# EAGLE design iv_diff (EAGLE 5.06)
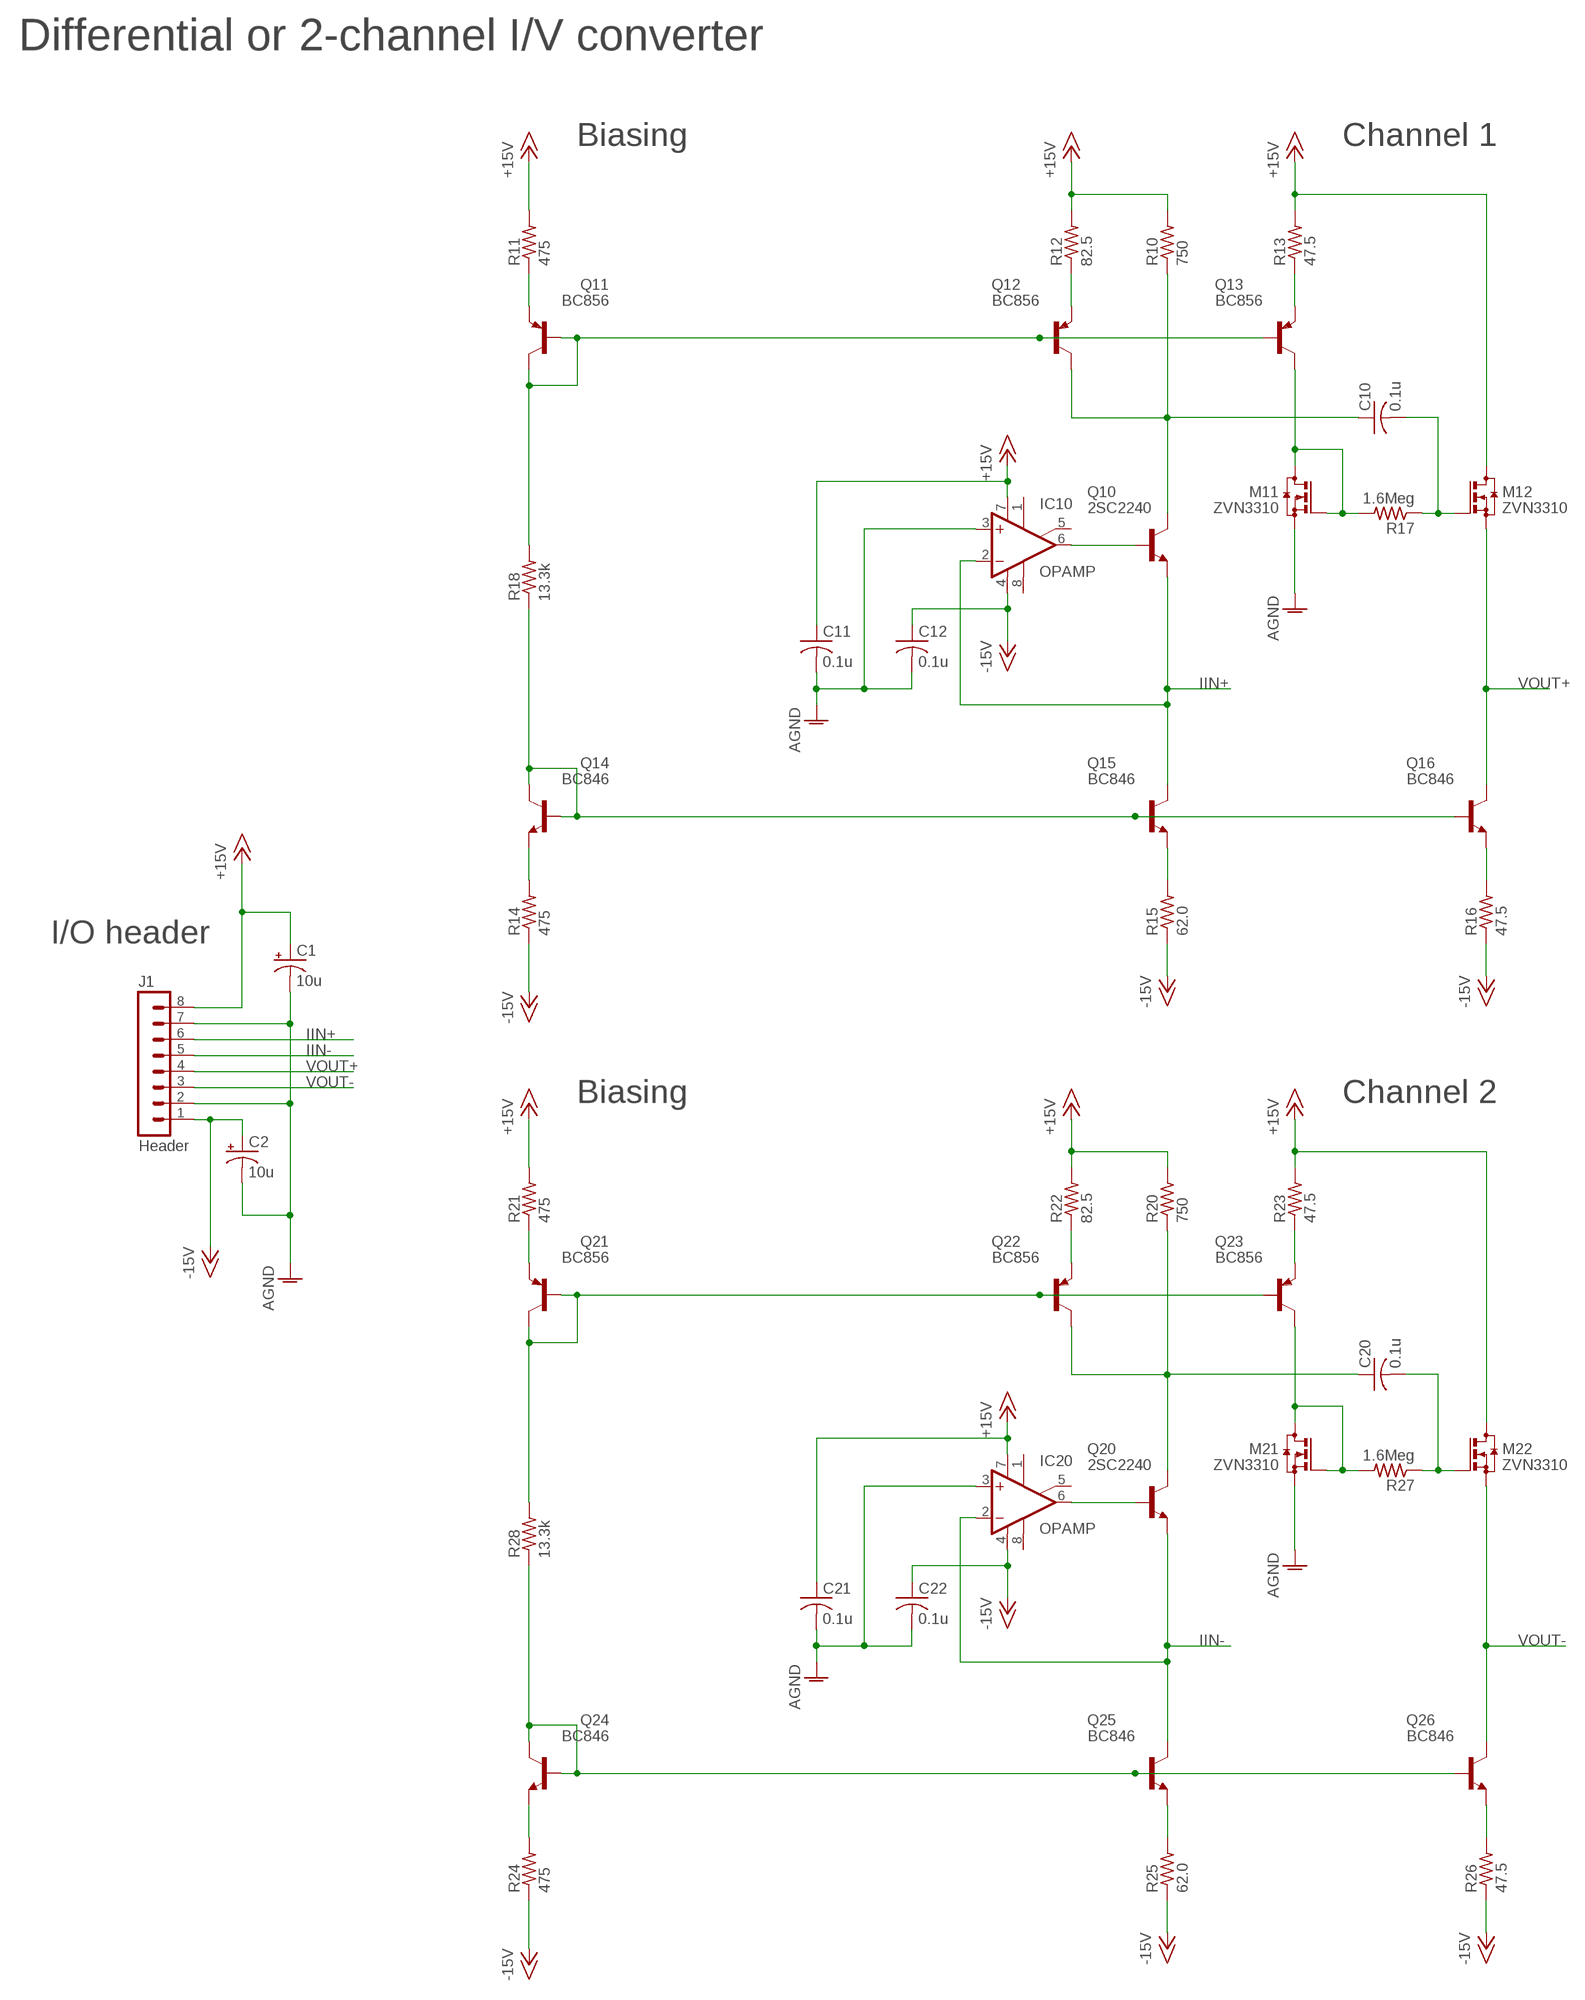
[diagram p0: schematic, sheet 1]

## Parts
C1  10u  CPOL-USC/6032-28R  [C/6032-28R]
C2  10u  CPOL-USC/6032-28R  [C/6032-28R]
C10  0.1u  C-USC1812  [C1812]
C11  0.1u  C-USC1206  [C1206]
C12  0.1u  C-USC1206  [C1206]
C20  0.1u  C-USC1812  [C1812]
C21  0.1u  C-USC1206  [C1206]
C22  0.1u  C-USC1206  [C1206]
IC10  OPAMP  AD797N  [DIL08]
IC20  OPAMP  AD797N  [DIL08]
J1  Header  MA08-1  [MA08-1]
M11  ZVN3310  BSS123  [SOT23]
M12  ZVN3310  BSS123  [SOT23]
M21  ZVN3310  BSS123  [SOT23]
M22  ZVN3310  BSS123  [SOT23]
Q10  2SC2240  [TO92-ECB]
Q11  BC856  BC856BSMD  [SOT23-BEC]
Q12  BC856  BC856BSMD  [SOT23-BEC]
Q13  BC856  BC856BSMD  [SOT23-BEC]
Q14  BC846  [SOT23]
Q15  BC846  [SOT23]
Q16  BC846  [SOT23]
Q20  2SC2240  [TO92-ECB]
Q21  BC856  BC856BSMD  [SOT23-BEC]
Q22  BC856  BC856BSMD  [SOT23-BEC]
Q23  BC856  BC856BSMD  [SOT23-BEC]
Q24  BC846  [SOT23]
Q25  BC846  [SOT23]
Q26  BC846  [SOT23]
R10  750  R-US_R1206  [R1206]
R11  475  R-US_R1206  [R1206]
R12  82.5  R-US_R1206  [R1206]
R13  47.5  R-US_R1206  [R1206]
R14  475  R-US_R1206  [R1206]
R15  62.0  R-US_R1206  [R1206]
R16  47.5  R-US_R1206  [R1206]
R17  1.6Meg  R-US_R1206  [R1206]
R18  13.3k  R-US_R1206  [R1206]
R20  750  R-US_R1206  [R1206]
R21  475  R-US_R1206  [R1206]
R22  82.5  R-US_R1206  [R1206]
R23  47.5  R-US_R1206  [R1206]
R24  475  R-US_R1206  [R1206]
R25  62.0  R-US_R1206  [R1206]
R26  47.5  R-US_R1206  [R1206]
R27  1.6Meg  R-US_R1206  [R1206]
R28  13.3k  R-US_R1206  [R1206]

## Nets
+15V: C1.+ C11.1 C21.1 IC10.7(V+) IC20.7(V+) J1.8 M12.3(D) M22.3(D) R10.2 R11.2 R12.2 R13.2 R20.2 R21.2 R22.2 R23.2
-15V: C2.+ C12.1 C22.1 IC10.4(V-) IC20.4(V-) J1.1 R14.1 R15.1 R16.1 R24.1 R25.1 R26.1
AGND: C1.- C2.- C11.2 C12.2 C21.2 C22.2 IC10.3(+IN) IC20.3(+IN) J1.2 J1.7 M11.2(S) M21.2(S)
IIN+: IC10.2(-IN) J1.6 Q10.E Q15.3(C)
IIN-: IC20.2(-IN) J1.5 Q20.E Q25.3(C)
N$1: Q14.2(E) R14.2
N$2: Q14.1(B) Q14.3(C) Q15.1(B) Q16.1(B) R18.1
N$3: Q24.2(E) R24.2
N$4: Q11.E R11.1
N$5: Q11.B Q11.C Q12.B Q13.B R18.2
N$6: Q12.E R12.1
N$7: C10.1 Q10.C Q12.C R10.1
N$8: Q24.1(B) Q24.3(C) Q25.1(B) Q26.1(B) R28.1
N$9: Q15.2(E) R15.2
N$10: IC10.6(OUT) Q10.B
N$11: Q13.E R13.1
N$12: Q21.E R21.1
N$13: Q16.2(E) R16.2
N$14: M11.1(G) M11.3(D) Q13.C R17.2
N$15: C10.2 M12.1(G) R17.1
N$16: Q21.B Q21.C Q22.B Q23.B R28.2
N$17: Q22.E R22.1
N$18: C20.1 Q20.C Q22.C R20.1
N$19: Q25.2(E) R25.2
N$20: IC20.6(OUT) Q20.B
N$21: Q23.E R23.1
N$22: Q26.2(E) R26.2
N$23: M21.1(G) M21.3(D) Q23.C R27.2
N$24: C20.2 M22.1(G) R27.1
VOUT+: J1.4 M12.2(S) Q16.3(C)
VOUT-: J1.3 M22.2(S) Q26.3(C)
Unconnected: IC10.1(ON1) IC10.5(ON2) IC10.8(OPT) IC20.1(ON1) IC20.5(ON2) IC20.8(OPT)

## Notes on the sheet
- Differential or 2-channel I/V converter
- Biasing | Channel 1
- I/O header
- Biasing | Channel 2

## Library data of the parts
C1 C2 = rcl:CPOL-US: POLARIZED CAPACITOR, American symbol
C10-C12 C20-C22 = rcl:C-US: CAPACITOR, American symbol
IC10 IC20 = linear:AD797: OP AMP
J1 = cdp:MA08-1: PIN HEADER
M11 M12 M21 M22 = transistor-small-signal:BSS123: N-CHANNEL MOS FET
Q10 Q20 = cdp:2SC2240: NPN Silicon Epitaxial Planar Transistor Source: SEMTECH ELECTRONICS LTD. ... 2SC945 2.pdf
Q11-Q13 Q21-Q23 = transistor-pnp:BC856*: PNP Transistror
Q14-Q16 Q24-Q26 = transistor:BC846: NPN TRANSISTOR
R10-R18 R20-R28 = rcl:R-US_: RESISTOR, American symbol

## Board
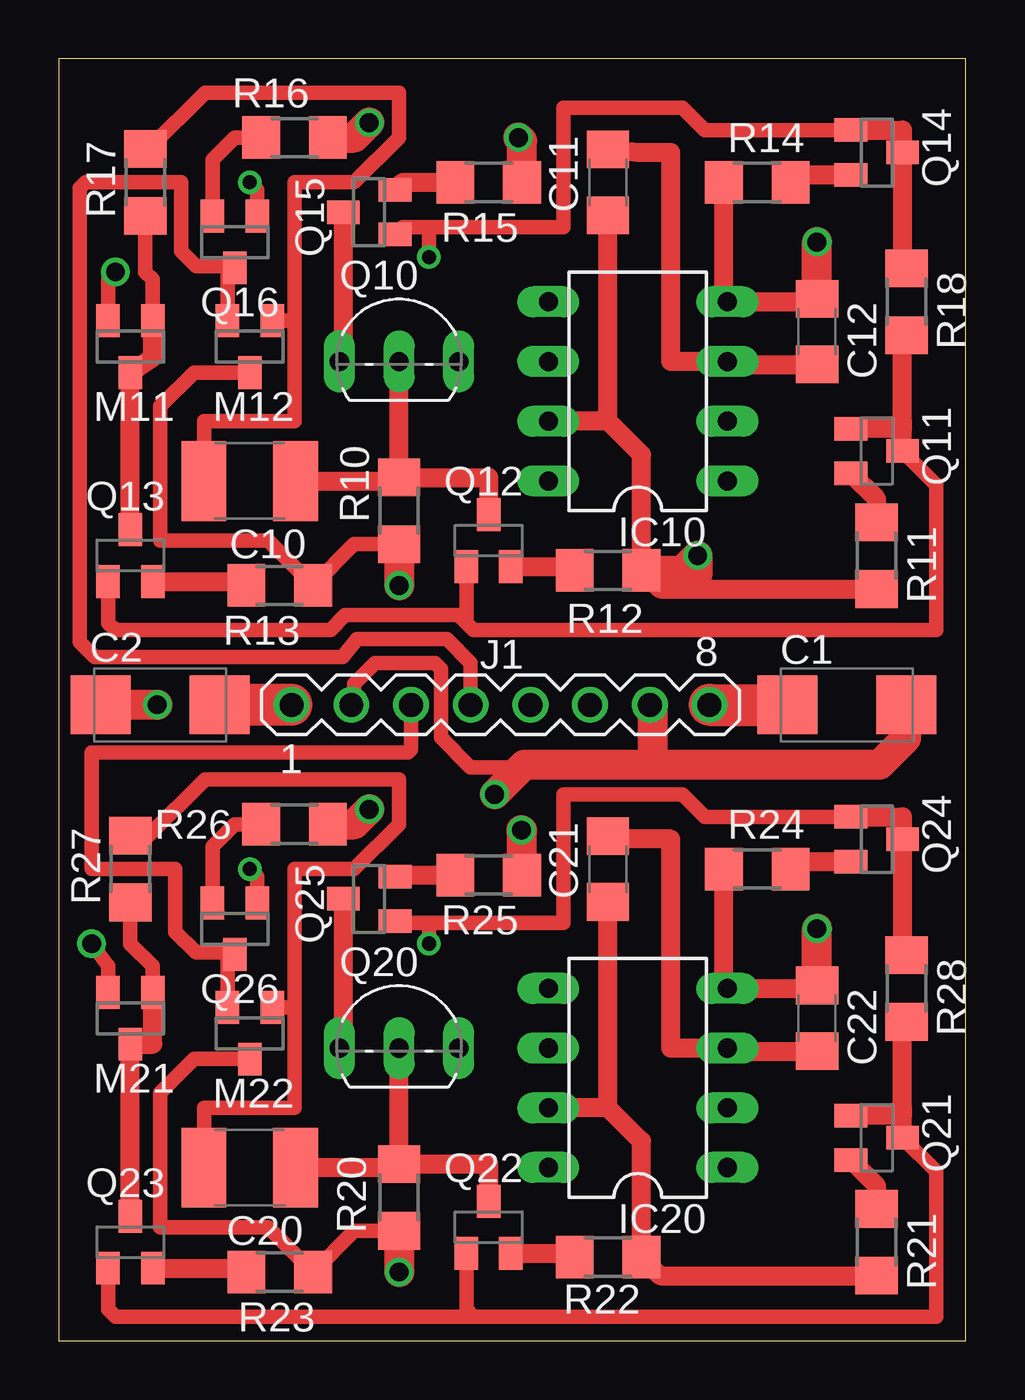
[diagram p1: board, top side]
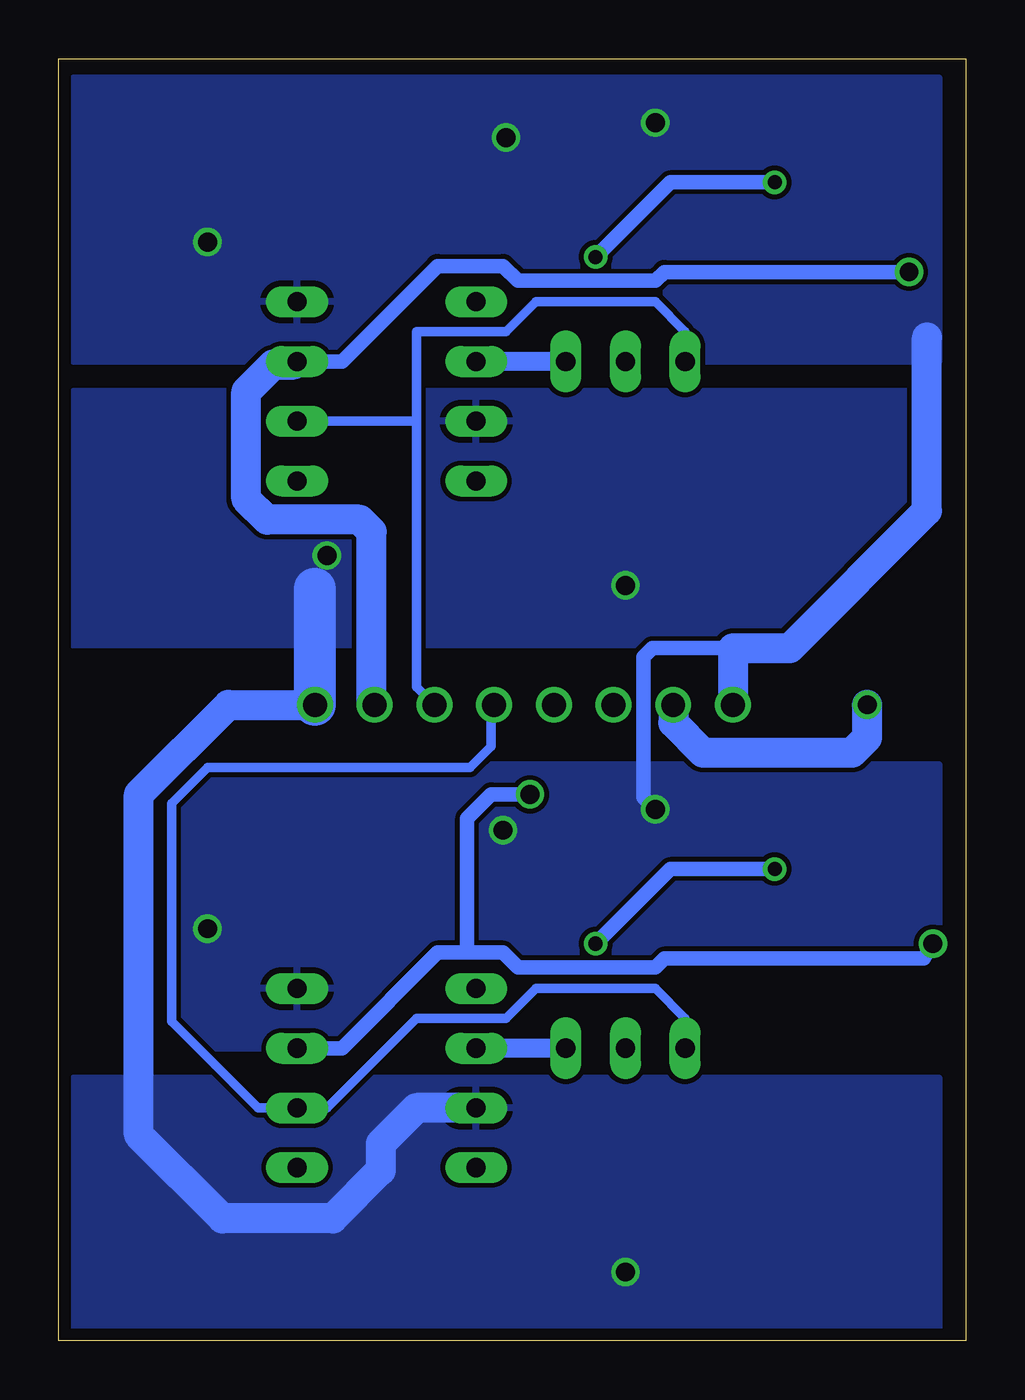
[diagram p2: board, bottom side, seen from below]

Size 38.59 x 54.53 mm. Coordinates in mm from the lower left corner, seen from the top.
Outline: 0,0 38.59,0 38.59,54.53 0,54.53 0,0
Copper layers (1*16): Top 0.035mm / dielectric 1.5mm / Bottom 0.035mm
Design rules "default *": minimum track width 10mil, minimum drill 20mil, track to track 8mil, track to pad 8mil, pad to pad 8mil, via to via 8mil, smd to smd 8mil, copper to edge 20mil, drill to drill 8mil, minimum pad ring 10mil, minimum via ring 8mil, stop-mask expansion 4mil, vias tented up to drill 0mil, thermal gap 10mil

### Footprints (pad centres in the part's own frame; a part is rotated, then mirrored left to right if it is on the bottom)
C/6032-28R = smd 2.55 x 2.5: + 2.525,0; - -2.525,0
C1812 = smd 1.9 x 3.4: 1 -1.95,0; 2 1.95,0
C1206 = smd 1.6 x 1.8: 1 -1.4,0; 2 1.4,0
DIL08 = drill 0.813 long: 1 -3.81,-3.81; 2 -1.27,-3.81; 3 1.27,-3.81; 4 3.81,-3.81; 5 3.81,3.81; 6 1.27,3.81; 7 -1.27,3.81; 8 -3.81,3.81
MA08-1 = drill 1.016 pad 1.422 round: 1 -8.89,0; 2 -6.35,0; 3 -3.81,0; 4 -1.27,0; 5 1.27,0; 6 3.81,0; 7 6.35,0; 8 8.89,0
SOT23 = smd 1 x 1.4: 1 -0.95,-1.1; 2 0.95,-1.1; 3 0,1.1
TO92-ECB = drill 0.813 long: B 2.54,0; C 0,0; E -2.54,0
SOT23-BEC = smd 1 x 1.4: B -0.95,-1.1; C 0,1.1; E 0.95,-1.1
R1206 = smd 1.6 x 1.803: 1 -1.422,0; 2 1.422,0

### Placement (x,y rotation side)
C1  33.53,27.05 180 top
C2  4.32,27.05 0 top
C10  8.13,36.58 180 top
C11  23.37,49.28 90 top
C12  32.26,42.93 270 top
C20  8.13,7.37 180 top
C21  23.37,20.07 90 top
C22  32.26,13.72 270 top
IC10  24.64,40.39 90 top
IC20  24.64,11.18 90 top
J1  18.8,27.05 0 top
M11  3.05,42.29 180 top
M12  8.13,42.29 180 top
M21  3.05,13.72 180 top
M22  8.13,13.08 180 top
Q10  14.48,41.66 0 top
Q11  34.8,37.85 270 top
Q12  18.29,34.04 0 top
Q13  3.05,33.4 0 top
Q14  34.8,50.55 270 top
Q15  13.21,48.01 90 top
Q16  7.49,46.74 180 top
Q20  14.48,12.45 0 top
Q21  34.8,8.64 270 top
Q22  18.29,4.83 0 top
Q23  3.05,4.19 0 top
Q24  34.8,21.34 270 top
Q25  13.21,18.8 90 top
Q26  7.49,17.53 180 top
R10  14.48,35.31 270 top
R11  34.8,33.4 270 top
R12  23.37,32.77 0 top
R13  9.4,32.13 0 top
R14  29.72,49.28 0 top
R15  18.29,49.28 180 top
R16  10.03,51.18 180 top
R17  3.68,49.28 270 top
R18  36.07,44.2 270 top
R20  14.48,6.1 270 top
R21  34.8,4.19 270 top
R22  23.37,3.56 0 top
R23  9.4,2.92 0 top
R24  29.72,20.07 0 top
R25  18.29,19.81 180 top
R26  10.03,21.97 180 top
R27  3.05,20.07 270 top
R28  36.07,14.99 270 top

### Tracks (layer width: path | path; a pad name or v marks a point on that pad's centre or on a via)
+15V  (via drill 0.8)
  Top 0.406: 27.18,32.64 27.18,32.49 27.69,31.98
  Top 0.61: M12.3 5.76,41.19 4.32,39.75 4.32,34.04 8.91,34.04 R13.2 12.57,33.88 R10.2 | M22.3 5.76,11.98 4.32,10.54 4.32,4.83 8.91,4.83 R23.2 12.57,4.67 R20.2
  Top 0.813: 23.37,39.12 IC10.7 | 23.37,39.12 C11.1 23.37,48.01 | R11.2 27.69,31.98 25.58,31.98 R12.2 24.79,37.69 23.37,39.12 | 23.37,9.91 IC20.7 | 23.37,9.91 C21.1 23.37,18.8 | R21.2 25.58,2.77 R22.2 24.79,8.48 23.37,9.91
  Top 1.27: R10.2 v14.48,32.13 | R20.2 v14.48,2.92 | R12.2 26.54,32.77 v27.18,33.4 27.18,32.64
  Top 1.778: J1.8 C1.+
  Bottom 1.27: IC20.7 23.37,9.91 24.89,8.38 24.89,7.24 26.92,5.21 31.62,5.21 35.18,8.76 35.18,23.24 31.37,27.05 J1.8
  Bottom 1.778: J1.8 27.69,31.98
  pour Bottom: 37.97,29.59 37.97,40.39 1.14,40.39 1.14,29.59
  pour Bottom: 37.97,0.38 37.97,11.18 1.14,11.18 1.14,0.38
-15V  (via drill 0.8)
  Top 0.813: C12.1 32.26,44.2 IC10.4 28.3,44.35 R14.1 | C22.1 32.26,14.99 IC20.4 28.3,15.14 R24.1
  Top 1.27: 32.26,44.2 v32.26,46.74 | R15.1 19.71,51.03 v19.56,51.18 | R16.1 12.57,51.18 v13.21,51.82 | 32.26,14.99 v32.26,17.53 | R25.1 19.71,21.69 v19.68,21.72 | R26.1 12.57,21.97 v13.21,22.61
  Top 1.778: J1.1 C2.+
  Bottom 0.61: 9.91,29.46 13.34,29.46 13.72,29.08 13.72,23.11 v13.21,22.61
  Bottom 1.27: J1.1 9.91,29.46 7.49,29.46 1.65,35.31 1.65,42.67
  pour Bottom: 37.97,41.66 37.97,53.72 1.14,53.72 1.14,41.66
  pour Bottom: 37.97,12.45 37.97,24.51 1.14,24.51 1.14,12.45
AGND  (via drill 0.8)
  Top 0.61: M11.2 2.1,45.15 v2.41,45.47 | M21.2 2.1,15.94 v1.4,16.89 | 19.49,24.19 19.3,24.38 17.53,24.38 16.26,25.65 16.26,28.57 16,28.83 13.46,28.83 12.57,27.94 12.57,27.18 J1.2
  Top 0.813: C12.2 28.45,41.53 IC10.3 26.04,41.66 26.04,50.55 24.64,50.55 C11.2 | C22.2 28.45,12.32 IC20.3 26.04,12.45 26.04,21.34 23.37,21.34 C21.2
  Top 1.27: C1.- 36.05,25.64 34.92,24.51 25.27,24.51 | 25.27,24.51 19.81,24.51 19.49,24.19 v18.54,23.24 | 25.27,24.51 25.27,26.92 J1.7 | v4.19,27.05 C2.- 1.78,27.05
  Bottom 0.61: v2.41,45.47 12.83,45.47 13.21,45.09 19.05,45.09 19.68,45.72 22.48,45.72 26.54,41.66 IC10.3 | v1.4,16.89 1.78,16.26 12.83,16.26 13.21,15.88 19.05,15.88 19.68,16.51 21.21,16.51 | 21.21,16.51 22.48,16.51 26.54,12.45 IC20.3 | 21.21,16.51 21.21,22.23 20.19,23.24 v18.54,23.24
  Bottom 1.27: IC10.3 28.58,41.53 29.46,41.53 30.61,40.38 30.61,35.81 29.72,34.92 25.78,34.92 25.27,34.42 25.27,27.18 J1.7 | v4.19,27.05 4.19,25.65 4.83,25.02 11.18,25.02 12.45,26.29 J1.2
IIN+
  Top 0.813: Q15.3 12.11,41.83 Q10.E
  Bottom 0.406: Q10.E 11.94,42.93 13.21,44.2 18.29,44.2 19.56,42.93 23.37,42.93 23.37,39.12 | 23.37,39.12 23.37,27.81 J1.6 | 23.37,39.12 IC10.2
IIN-
  Top 0.813: Q25.3 12.11,12.62 Q20.E
  Bottom 0.406: Q20.E 11.94,13.72 13.21,14.99 18.29,14.99 19.56,13.72 23.37,13.72 27.18,9.91 IC20.2 30.1,9.91 33.78,13.59 33.78,22.86 32.26,24.38 21.08,24.38 20.19,25.27 20.19,26.92 J1.5
N$1
  Top 0.813: Q14.2 31.46,49.6 R14.2
N$2  (via drill 0.6)
  Top 0.61: Q14.1 27.5,51.5 26.54,52.45 21.46,52.45 21.46,47.37 14.63,47.37 | 14.63,47.37 Q15.1 | Q16.1 8.44,48.96 v8.13,49.28 | 14.63,47.37 15.75,47.37 v15.75,46.1
  Top 0.813: R18.1 35.9,45.62 Q14.3 35.9,51.5 Q14.1
  Bottom 0.61: v8.13,49.28 12.57,49.28 v15.75,46.1
N$3
  Top 0.813: Q24.2 31.46,20.39 R24.2
N$4
  Top 0.813: R11.1 34.8,35.8 Q11.E
N$5
  Top 0.61: Q12.B 17.34,30.54 17.65,30.23 | 17.65,30.23 37.34,30.23 37.34,36.41 Q11.C | Q13.B 2.1,30.54 2.41,30.23 11.56,30.23 12.19,30.86 17.02,30.86 17.65,30.23
  Top 0.813: R18.2 35.9,42.77 35.9,39.12 | Q11.C 35.9,39.12 | Q11.B 35.9,38.8 35.9,39.12
N$6
  Top 0.813: R12.1 21.95,32.94 Q12.E
N$7
  Top 0.813: R10.1 Q10.C | Q12.C 18.29,36.73 R10.1 | R10.1 14.48,36.58 C10.1
N$8  (via drill 0.6)
  Top 0.61: Q24.1 27.5,22.29 26.54,23.24 21.46,23.24 21.46,17.78 15.75,17.78 | Q25.1 14.63,17.78 15.75,17.78 | Q26.1 8.44,19.75 v8.13,20.07 | v15.75,16.89 15.75,17.78
  Top 0.813: R28.1 35.9,16.41 Q24.3 35.9,22.29 Q24.1
  Bottom 0.61: v8.13,20.07 12.57,20.07 v15.75,16.89
N$9
  Top 0.813: R15.2 14.63,49.28 Q15.2
N$10
  Bottom 0.813: Q10.B IC10.6
N$11
  Top 0.813: R13.1 7.98,32.3 Q13.E
N$12
  Top 0.813: R21.1 34.8,6.59 Q21.E
N$13
  Top 0.61: Q16.2 6.54,50.23 7.49,51.18 R16.2
N$14
  Top 0.61: M11.1 4,45.15 3.68,45.47 R17.2
  Top 0.813: Q13.C M11.3 4,41.83 M11.1
N$15
  Top 0.61: C10.2 6.18,39.12 10.03,39.12 10.03,43.39 | 10.03,43.39 M12.1 | R17.1 3.83,50.7 6.22,53.09 14.48,53.09 14.48,51.18 12.57,49.28 10.03,49.28 10.03,43.39
N$16
  Top 0.61: Q22.B 17.34,1.33 17.65,1.02 | 17.65,1.02 37.34,1.02 37.34,7.2 Q21.C | Q23.B 2.1,1.33 2.41,1.02 17.65,1.02
  Top 0.813: R28.2 35.9,13.56 35.9,9.91 | Q21.C 35.9,9.91 | Q21.B 35.9,9.59 35.9,9.91
N$17
  Top 0.813: R22.1 21.95,3.73 Q22.E
N$18
  Top 0.813: R20.1 Q20.C | Q22.C 18.29,7.52 R20.1 | R20.1 14.48,7.37 C20.1
N$19
  Top 0.813: R25.2 14.63,19.81 Q25.2
N$20
  Bottom 0.813: Q20.B IC20.6
N$21
  Top 0.813: R23.1 7.98,3.09 Q23.E
N$22
  Top 0.61: Q26.2 6.54,21.02 7.49,21.97 R26.2
N$23
  Top 0.61: M21.1 4,15.94 3.05,16.89 R27.2
  Top 0.813: Q23.C M21.3 4,12.62 M21.1
N$24
  Top 0.61: C20.2 6.18,9.91 10.03,9.91 10.03,14.18 | 10.03,14.18 M22.1 | R27.1 3.83,21.49 6.22,23.88 14.48,23.88 14.48,21.97 12.57,20.07 10.03,20.07 10.03,14.18
VOUT+
  Top 0.61: M12.2 7.18,45.96 Q16.3 7.41,45.72 5.84,45.72 5.21,46.35 5.21,49.28 1.14,49.28 0.89,49.02 0.89,29.72 1.52,29.08 12.06,29.08 12.7,29.84 16.51,29.84 17.53,28.83 J1.4
VOUT-
  Top 0.61: M22.2 7.18,16.75 Q26.3 7.41,16.51 5.84,16.51 4.95,17.4 4.95,20.07 1.4,20.07 1.4,25.02 14.86,25.02 14.99,25.15 J1.3